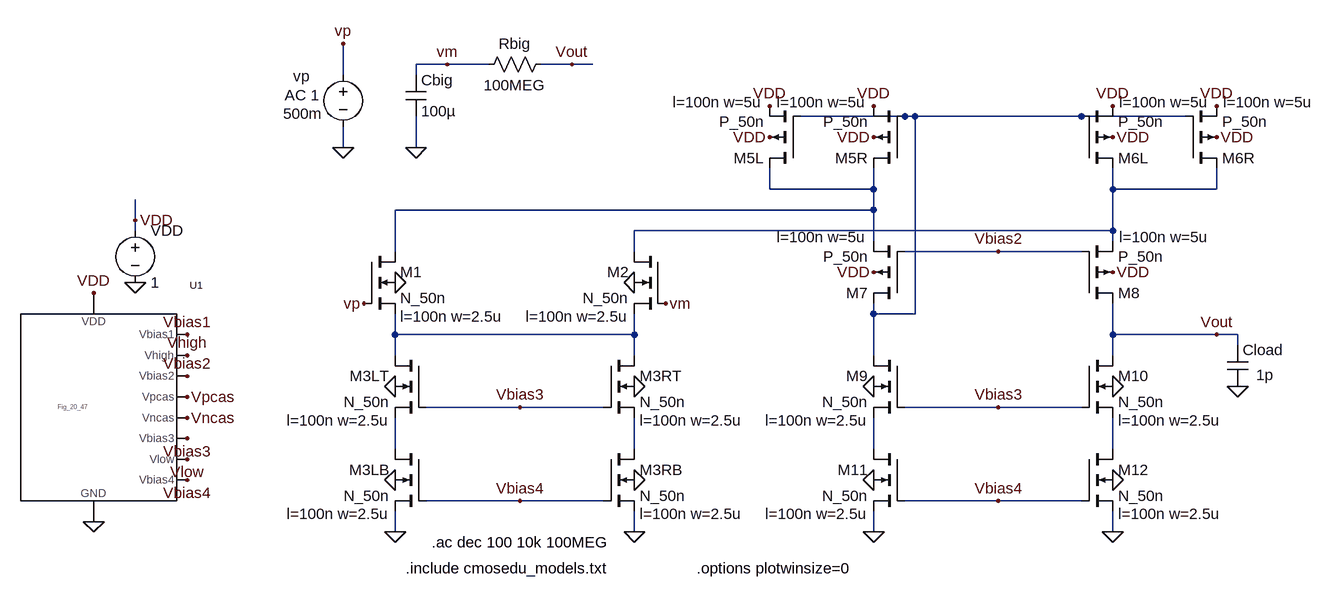
[diagram p0: schematic Fig24_43.asc]
Fig24_43.asc, the LTspice schematic file:
Version 4
SHEET 1 3184 680
WIRE 1824 -896 1776 -896
WIRE 1888 -896 1824 -896
WIRE 2016 -896 1968 -896
WIRE 2048 -896 2016 -896
WIRE 1664 -880 1664 -928
WIRE 1776 -880 1776 -896
WIRE 2528 -816 2368 -816
WIRE 2544 -816 2528 -816
WIRE 2800 -816 2544 -816
WIRE 2960 -816 2800 -816
WIRE 1664 -768 1664 -800
WIRE 1776 -768 1776 -816
WIRE 2320 -704 2320 -736
WIRE 2480 -704 2480 -736
WIRE 2480 -704 2320 -704
WIRE 2848 -704 2848 -736
WIRE 3008 -704 3008 -736
WIRE 3008 -704 2848 -704
WIRE 2480 -672 2480 -704
WIRE 2480 -672 1744 -672
WIRE 1344 -656 1344 -688
WIRE 1344 -640 1344 -656
WIRE 2848 -640 2848 -704
WIRE 2848 -640 2112 -640
WIRE 2480 -624 2480 -672
WIRE 2848 -624 2848 -640
WIRE 1744 -608 1744 -672
WIRE 2112 -608 2112 -640
WIRE 2672 -608 2528 -608
WIRE 2800 -608 2672 -608
WIRE 2480 -512 2480 -528
WIRE 2544 -512 2544 -816
WIRE 2544 -512 2480 -512
WIRE 1744 -480 1744 -512
WIRE 2112 -480 2112 -512
WIRE 2112 -480 1744 -480
WIRE 2848 -480 2848 -528
WIRE 3008 -480 2848 -480
WIRE 3040 -480 3008 -480
WIRE 3040 -464 3040 -480
WIRE 1744 -448 1744 -480
WIRE 2112 -448 2112 -480
WIRE 2480 -448 2480 -512
WIRE 2848 -448 2848 -480
WIRE 1936 -368 1792 -368
WIRE 2064 -368 1936 -368
WIRE 2672 -368 2528 -368
WIRE 2800 -368 2672 -368
WIRE 1744 -304 1744 -352
WIRE 2112 -304 2112 -352
WIRE 2480 -304 2480 -352
WIRE 2848 -304 2848 -352
WIRE 1936 -224 1792 -224
WIRE 2064 -224 1936 -224
WIRE 2672 -224 2528 -224
WIRE 2800 -224 2672 -224
WIRE 1744 -176 1744 -208
WIRE 2112 -176 2112 -208
WIRE 2480 -176 2480 -208
WIRE 2848 -176 2848 -208
FLAG 1344 -560 0
FLAG 1344 -656 VDD
FLAG 1280 -544 VDD
FLAG 1280 -192 0
FLAG 1424 -480 Vbias1
FLAG 1424 -448 Vhigh
FLAG 1424 -416 Vbias2
FLAG 1424 -320 Vbias3
FLAG 1424 -384 Vpcas
FLAG 1424 -352 Vncas
FLAG 1424 -256 Vbias4
FLAG 1424 -288 Vlow
FLAG 3008 -784 VDD
FLAG 1744 -560 0
FLAG 2112 -560 0
FLAG 1696 -528 vp
FLAG 2160 -528 vm
FLAG 2112 -400 0
FLAG 2112 -256 0
FLAG 2112 -176 0
FLAG 1744 -400 0
FLAG 1744 -256 0
FLAG 1744 -176 0
FLAG 1936 -368 Vbias3
FLAG 1936 -224 Vbias4
FLAG 2848 -400 0
FLAG 2848 -256 0
FLAG 2848 -176 0
FLAG 2480 -400 0
FLAG 2480 -256 0
FLAG 2480 -176 0
FLAG 2672 -368 Vbias3
FLAG 2672 -224 Vbias4
FLAG 2848 -784 VDD
FLAG 2848 -832 VDD
FLAG 3008 -832 VDD
FLAG 2320 -784 VDD
FLAG 2480 -784 VDD
FLAG 2480 -832 VDD
FLAG 2320 -832 VDD
FLAG 2848 -576 VDD
FLAG 2480 -576 VDD
FLAG 2672 -608 Vbias2
FLAG 3040 -400 0
FLAG 1664 -768 0
FLAG 1664 -928 vp
FLAG 1776 -768 0
FLAG 2016 -896 Vout
FLAG 3008 -480 Vout
FLAG 1824 -896 vm
SYMBOL voltage 1344 -656 R0
WINDOW 123 0 0 Left 2
WINDOW 39 0 0 Left 2
SYMATTR InstName VDD
SYMATTR Value 1
SYMBOL Fig_20_47 1280 -368 R0
SYMATTR InstName U1
SYMBOL pmos4 2960 -736 M180
WINDOW 123 58 102 Left 2
WINDOW 0 56 16 Left 2
SYMATTR Value2 l=100n w=5u
SYMATTR InstName M6R
SYMATTR Value P_50n
SYMBOL nmos4 1696 -608 R0
WINDOW 123 56 100 Left 2
SYMATTR Value2 l=100n w=2.5u
SYMATTR InstName M1
SYMATTR Value N_50n
SYMBOL nmos4 2160 -608 M0
WINDOW 123 56 100 Left 2
SYMATTR Value2 l=100n w=2.5u
SYMATTR InstName M2
SYMATTR Value N_50n
SYMBOL nmos4 2064 -448 R0
WINDOW 123 56 100 Left 2
SYMATTR Value2 l=100n w=2.5u
SYMATTR InstName M3RT
SYMATTR Value N_50n
SYMBOL nmos4 2064 -304 R0
WINDOW 123 56 100 Left 2
SYMATTR Value2 l=100n w=2.5u
SYMATTR InstName M3RB
SYMATTR Value N_50n
SYMBOL nmos4 1792 -448 M0
WINDOW 123 56 100 Left 2
SYMATTR Value2 l=100n w=2.5u
SYMATTR InstName M3LT
SYMATTR Value N_50n
SYMBOL nmos4 1792 -304 M0
WINDOW 123 56 100 Left 2
SYMATTR Value2 l=100n w=2.5u
SYMATTR InstName M3LB
SYMATTR Value N_50n
SYMBOL nmos4 2800 -448 R0
WINDOW 123 56 100 Left 2
SYMATTR Value2 l=100n w=2.5u
SYMATTR InstName M10
SYMATTR Value N_50n
SYMBOL nmos4 2800 -304 R0
WINDOW 123 56 100 Left 2
SYMATTR Value2 l=100n w=2.5u
SYMATTR InstName M12
SYMATTR Value N_50n
SYMBOL nmos4 2528 -448 M0
WINDOW 123 56 100 Left 2
SYMATTR Value2 l=100n w=2.5u
SYMATTR InstName M9
SYMATTR Value N_50n
SYMBOL nmos4 2528 -304 M0
WINDOW 123 56 100 Left 2
SYMATTR Value2 l=100n w=2.5u
SYMATTR InstName M11
SYMATTR Value N_50n
SYMBOL pmos4 2800 -736 M180
WINDOW 123 58 102 Left 2
WINDOW 0 56 16 Left 2
SYMATTR Value2 l=100n w=5u
SYMATTR InstName M6L
SYMATTR Value P_50n
SYMBOL pmos4 2368 -736 R180
WINDOW 123 58 102 Left 2
WINDOW 0 56 16 Left 2
SYMATTR Value2 l=100n w=5u
SYMATTR InstName M5L
SYMATTR Value P_50n
SYMBOL pmos4 2528 -736 R180
WINDOW 123 58 102 Left 2
WINDOW 0 56 16 Left 2
SYMATTR Value2 l=100n w=5u
SYMATTR InstName M5R
SYMATTR Value P_50n
SYMBOL pmos4 2800 -528 M180
WINDOW 123 58 102 Left 2
WINDOW 0 56 16 Left 2
SYMATTR Value2 l=100n w=5u
SYMATTR InstName M8
SYMATTR Value P_50n
SYMBOL pmos4 2528 -528 R180
WINDOW 123 58 102 Left 2
WINDOW 0 56 16 Left 2
SYMATTR Value2 l=100n w=5u
SYMATTR InstName M7
SYMATTR Value P_50n
SYMBOL cap 3024 -464 R0
WINDOW 3 45 46 Left 2
SYMATTR Value 1p
SYMATTR InstName Cload
SYMBOL voltage 1664 -896 R0
WINDOW 0 -77 18 Left 2
WINDOW 3 -92 76 Left 2
WINDOW 123 -90 47 Left 2
WINDOW 39 0 0 Left 2
SYMATTR InstName vp
SYMATTR Value 500m
SYMATTR Value2 AC 1
SYMBOL cap 1760 -880 R0
SYMATTR InstName Cbig
SYMATTR Value 100µ
SYMBOL res 1872 -880 R270
WINDOW 0 32 56 VTop 2
WINDOW 3 0 56 VBottom 2
SYMATTR InstName Rbig
SYMATTR Value 100MEG
TEXT 1760 -120 Left 2 !.include cmosedu_models.txt
TEXT 1800 -160 Left 2 !.ac dec 100 10k 100MEG
TEXT 2208 -120 Left 2 !.options plotwinsize=0

The netlist it stands for:
* Fig24_43.asc
VDD VDD 0 1
XU1 Vbias1 Vhigh Vbias2 Vpcas Vncas Vbias3 Vlow Vbias4 VDD 0 Fig_20_47  ; pins Vbias1 Vhigh Vbias2 Vpcas Vncas Vbias3 Vlow Vbias4 VDD GND
M6R N003 N001 VDD VDD P_50n l=100n w=5u
M1 N002 vp N004 0 N_50n l=100n w=2.5u
M2 N003 vm N004 0 N_50n l=100n w=2.5u
M3RT N004 Vbias3 N006 0 N_50n l=100n w=2.5u
M3RB N006 Vbias4 0 0 N_50n l=100n w=2.5u
M3LT N004 Vbias3 N005 0 N_50n l=100n w=2.5u
M3LB N005 Vbias4 0 0 N_50n l=100n w=2.5u
M10 Vout Vbias3 N008 0 N_50n l=100n w=2.5u
M12 N008 Vbias4 0 0 N_50n l=100n w=2.5u
M9 N001 Vbias3 N007 0 N_50n l=100n w=2.5u
M11 N007 Vbias4 0 0 N_50n l=100n w=2.5u
M6L N003 N001 VDD VDD P_50n l=100n w=5u
M5L N002 N001 VDD VDD P_50n l=100n w=5u
M5R N002 N001 VDD VDD P_50n l=100n w=5u
M8 Vout Vbias2 N003 VDD P_50n l=100n w=5u
M7 N001 Vbias2 N002 VDD P_50n l=100n w=5u
Cload Vout 0 1p
vp vp 0 500m AC 1
Cbig vm 0 100µ
Rbig vm Vout 100MEG
.model NMOS NMOS
.model PMOS PMOS
.lib standard.mos
.include cmosedu_models.txt
.ac dec 100 10k 100MEG
.options plotwinsize=0
.backanno
.end